# EAGLE design SimpleCodingBot (EAGLE 9.4.2)
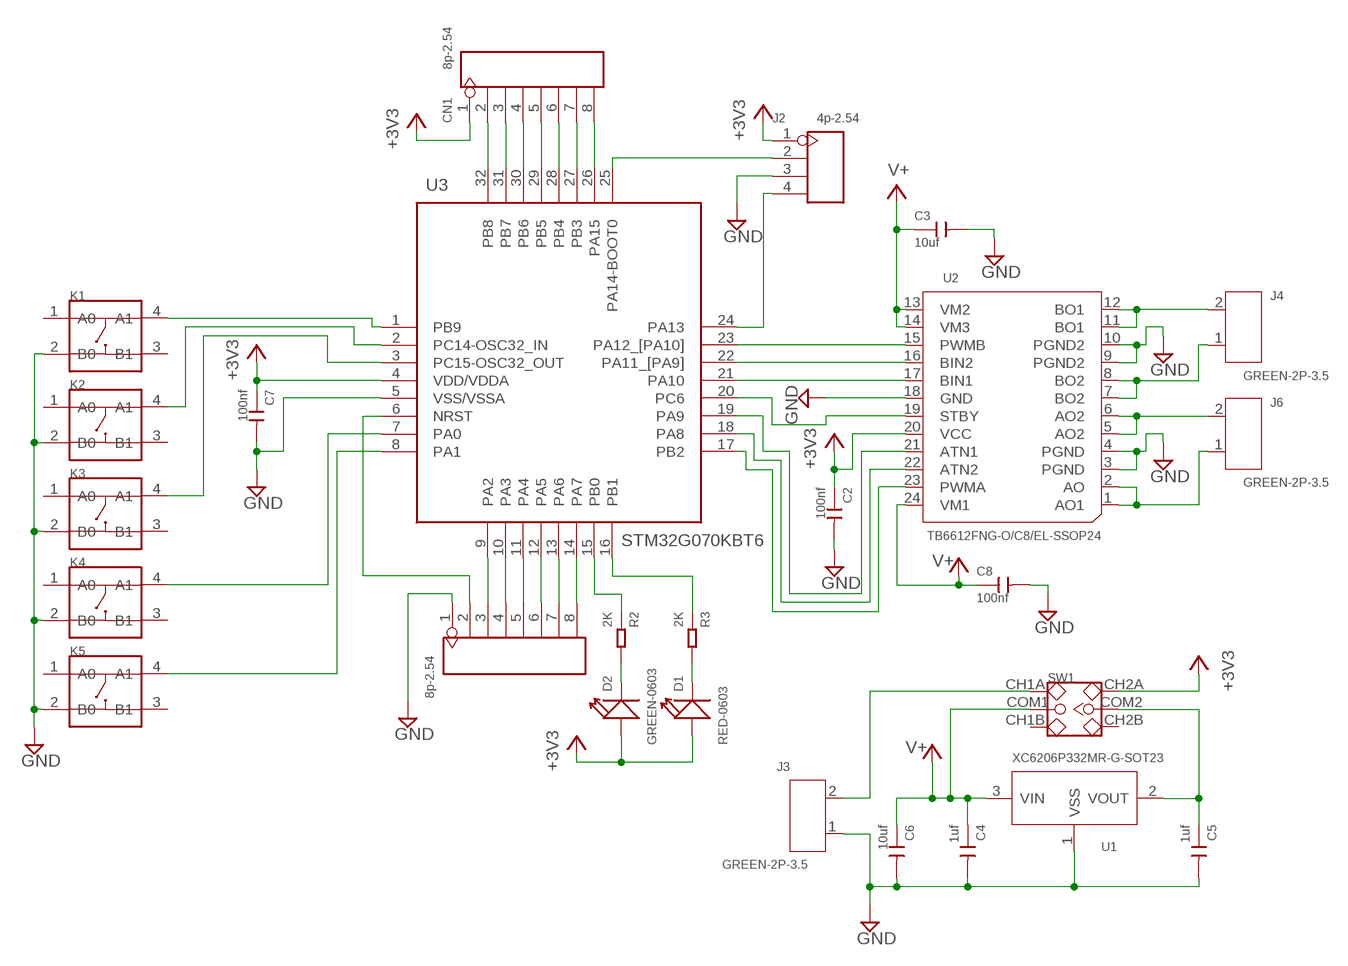
[diagram p0: schematic, sheet 1]

## Parts
C2  100nf  CERAMIC-100NF-50V-10%-X7R(0603)  [C0603]
C3  10uf  CERAMIC-10UF-10V-10%-X5R(0603)  [C0603]
C4  1uf  CERAMIC-1UF-25V-10%-X7R(0603)  [C0603]
C5  1uf  CERAMIC-1UF-25V-10%-X7R(0603)  [C0603]
C6  10uf  CERAMIC-10UF-10V-10%-X5R(0603)  [C0603]
C7  100nf  CERAMIC-100NF-50V-10%-X7R(0603)  [C0603]
C8  100nf  CERAMIC-100NF-50V-10%-X7R(0603)  [C0603]
CN1  8p-2.54  DIP-BLACK-FEMALE-HEADER-VERT(8P-2.54)  [H8-2.54]
CN2  8p-2.54  DIP-BLACK-FEMALE-HEADER-VERT(8P-2.54)  [H8-2.54]
D1  RED-0603  LED-SMD-RED-DIFFUSED(0603)  [LED-0603]
D2  GREEN-0603  SMD-LED-CLEAR-GREEN(0603)  [LED-0603]
J2  4p-2.54  DIP-BLACK-MALE-HEADER-VERT(4P-2.54)  [H4-2.54]
J3  GREEN-2P-3.5  SCREW-TERMINAL-GREEN(2P-3.5)  [H2-3.5-7.0X7.0MM]
J4  GREEN-2P-3.5  SCREW-TERMINAL-GREEN(2P-3.5)  [H2-3.5-7.0X7.0MM]
J6  GREEN-2P-3.5  SCREW-TERMINAL-GREEN(2P-3.5)  [H2-3.5-7.0X7.0MM]
K1  DIP-SWITCH-TACTILE-SPST-NO/TS-1109(4P-D6.0MM)'TS-1109'  [SW4-6.0X6.0X5.0MM]
K2  DIP-SWITCH-TACTILE-SPST-NO/TS-1109(4P-D6.0MM)'TS-1109'  [SW4-6.0X6.0X5.0MM]
K3  DIP-SWITCH-TACTILE-SPST-NO/TS-1109(4P-D6.0MM)'TS-1109'  [SW4-6.0X6.0X5.0MM]
K4  DIP-SWITCH-TACTILE-SPST-NO/TS-1109(4P-D6.0MM)'TS-1109'  [SW4-6.0X6.0X5.0MM]
K5  DIP-SWITCH-TACTILE-SPST-NO/TS-1109(4P-D6.0MM)'TS-1109'  [SW4-6.0X6.0X5.0MM]
R2  2K  SMD-RES-2K-1%-1/10W(0603)  [R0603]
R3  2K  SMD-RES-2K-1%-1/10W(0603)  [R0603]
SW1  DIP-TOGGLE-SWITCH-2CH-(2X3P-2.54)  [SW6-2.54-9.0X3.5X3.2+2.0MM]
U1  XC6206P332MR-G-SOT23  PMIC-LDO-XC6206P332MR-G(SOT23)  [SOT-23]
U2  TB6612FNG-O/C8/EL-SSOP24  DRIVER-TB6612FNG-O/C8/EL(SSOP24)  [SSOP24-0.65-8.9X5.3MM]
U3  STM32G070KBT6  [QFP80P900X900X160-32N]

## Nets
+3V3: C2.1 C7.1 CN1.1 D1.+ D2.+ J2.1 SW1.CH2A U2.20(VCC) U3.4(VDD/VDDA)
GND: C2.2 C3.2 C4.2 C5.2 C6.2 C7.2 C8.2 CN2.1 J2.3 J3.1 K1.2(B0) K2.2(B0) K3.2(B0) K4.2(B0) K5.2(B0) U1.1(VSS) U2.3(PGND) U2.4(PGND) U2.9(PGND2) U2.10(PGND2) U2.18(GND) U3.5(VSS/VSSA)
N$1: CN1.6 U3.28(PB4)
N$2: C5.1 SW1.COM2 U1.2(VOUT)
N$3: K1.4(A1) U3.1(PB9)
N$4: K2.4(A1) U3.2(PC14-OSC32_IN)
N$5: K3.4(A1) U3.3(PC15-OSC32_OUT)
N$6: K4.4(A1) U3.7(PA0)
N$7: K5.4(A1) U3.8(PA1)
N$8: J2.2 U3.25(PA14-BOOT0)
N$9: J2.4 U3.24(PA13)
N$10: D1.- R3.2
N$11: J3.2 SW1.CH1A
N$13: R3.1 U3.16(PB1)
N$14: R2.1 U3.15(PB0)
N$15: CN2.8 U3.14(PA7)
N$16: U2.15(PWMB) U3.23(PA12_[PA10])
N$17: U2.16(BIN2) U3.22(PA11_[PA9])
N$18: CN1.5 U3.29(PB5)
N$19: CN1.4 U3.30(PB6)
N$20: CN1.3 U3.31(PB7)
N$21: CN1.2 U3.32(PB8)
N$22: U2.17(BIN1) U3.21(PA10)
N$23: CN2.7 U3.13(PA6)
N$24: CN2.6 U3.12(PA5)
N$25: CN1.7 U3.27(PB3)
N$26: CN2.5 U3.11(PA4)
N$27: U2.21(ATN1) U3.19(PA9)
N$28: CN2.4 U3.10(PA3)
N$29: U2.22(ATN2) U3.18(PA8)
N$30: U2.23(PWMA) U3.17(PB2)
N$31: CN2.3 U3.9(PA2)
N$32: U2.19(STBY) U3.20(PC6)
N$33: CN1.8 U3.26(PA15)
N$34: D2.- R2.2
N$35: CN2.2 U3.6(NRST)
N$37: J4.2 U2.11(BO1) U2.12(BO1)
N$38: J4.1 U2.7(BO2) U2.8(BO2)
N$40: J6.2 U2.5(AO2) U2.6(AO2)
N$42: J6.1 U2.1(AO1) U2.2(AO)
V+: C3.1 C4.1 C6.1 C8.1 SW1.COM1 U1.3(VIN) U2.13(VM2) U2.14(VM3) U2.24(VM1)
Unconnected: K1.1(A0) K1.3(B1) K2.1(A0) K2.3(B1) K3.1(A0) K3.3(B1) K4.1(A0) K4.3(B1) K5.1(A0) K5.3(B1) SW1.CH1B SW1.CH2B

## Library data of the parts
C2 C7 C8 = OPL_Capacitor:CERAMIC-100NF-50V-10%-X7R(0603): 302010138; MPN: CC0603KRX7R9BB104
C3 C6 = OPL_Capacitor:CERAMIC-10UF-10V-10%-X5R(0603): 302010103; MPN: CC0603KRX5R6BB106
C4 C5 = OPL_Capacitor:CERAMIC-1UF-25V-10%-X7R(0603): 302010139; MPN: CC0603KRX7R8BB105
CN1 CN2 = OPL_Connector:DIP-BLACK-FEMALE-HEADER-VERT(8P-2.54): 320030061; MPN: F185-1108A1BSYC1
D1 = OPL_Optoelectronics:LED-SMD-RED-DIFFUSED(0603): 304090042; MPN: 19-217-R6C-AL1M2VY-3T
D2 = OPL_Optoelectronics:SMD-LED-CLEAR-GREEN(0603): 304090043; MPN: 19-217-G7C-AN1P2-3T
J2 = OPL_Connector:DIP-BLACK-MALE-HEADER-VERT(4P-2.54): 320020017; MPN: P125-1104A0BS116A1
J3 J4 J6 = OPL_Connector:SCREW-TERMINAL-GREEN(2P-3.5): 320110028
K1-K5 = OPL_Switch:DIP-SWITCH-TACTILE-SPST-NO/TS-1109(4P-D6.0MM): 311020024
R2 R3 = OPL_Resistor:SMD-RES-2K-1%-1/10W(0603): 301010221; MPN: RC0603FR-072KL
SW1 = OPL_Switch:DIP-TOGGLE-SWITCH-2CH-(2X3P-2.54): 311010004; MPN: MS-22D18 G2 ROHS
U1 = OPL_IC:PMIC-LDO-XC6206P332MR-G(SOT23): 310030099; MPN: XC6206P332MR-G
U2 = OPL_IC:DRIVER-TB6612FNG-O/C8/EL(SSOP24): 310040007; MPN: TB6612FNG-O/C8/EL
U3 = SamacSys_Parts:STM32G070KBT6: 32-bit Microcontrollers - MCU Arm Cortex -M0+ 32-bit MCU, 128 KB Flash, 36 KB RAM, 4x USART, timers, ADC, comm. I/Fs, 2.0-3.6V Source: Datasheet <https://componentsearchengine.com/Datasheets/1/STM32G070KBT6.pdf>; DESCRIPTION: 32-bit Microcontrollers - MCU Arm Cortex -M0+ 32-bit MCU, 128 KB Flash, 36 KB RAM, 4x USART, timers, ADC, comm. I/Fs, 2.0-3.6V; HEIGHT: 1.6mm; MANUFACTURER_NAME: STMicroelectronics; MANUFACTURER_PART_NUMBER: STM32G070KBT6; MOUSER_PART_NUMBER: 511-STM32G070KBT6; MOUSER_PRICE-STOCK: https://www.mouser.com/Search/Refine.aspx?Keyword=511-STM32G070KBT6

## Net classes
0 default: width 0.254 mm, clearance 0.152 mm

## Board
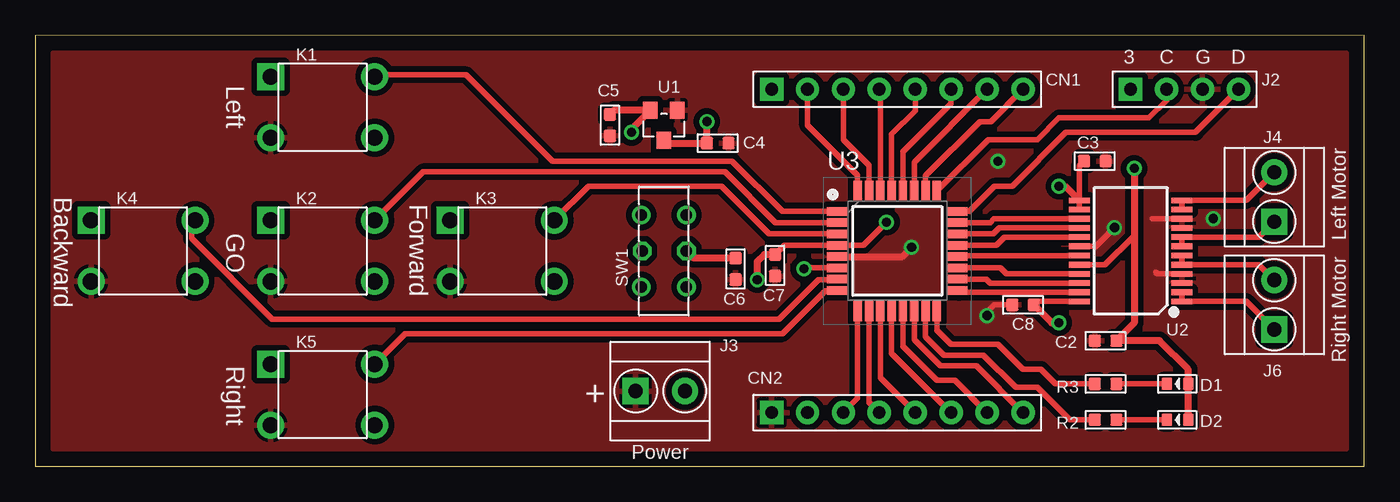
[diagram p1: board, top side]
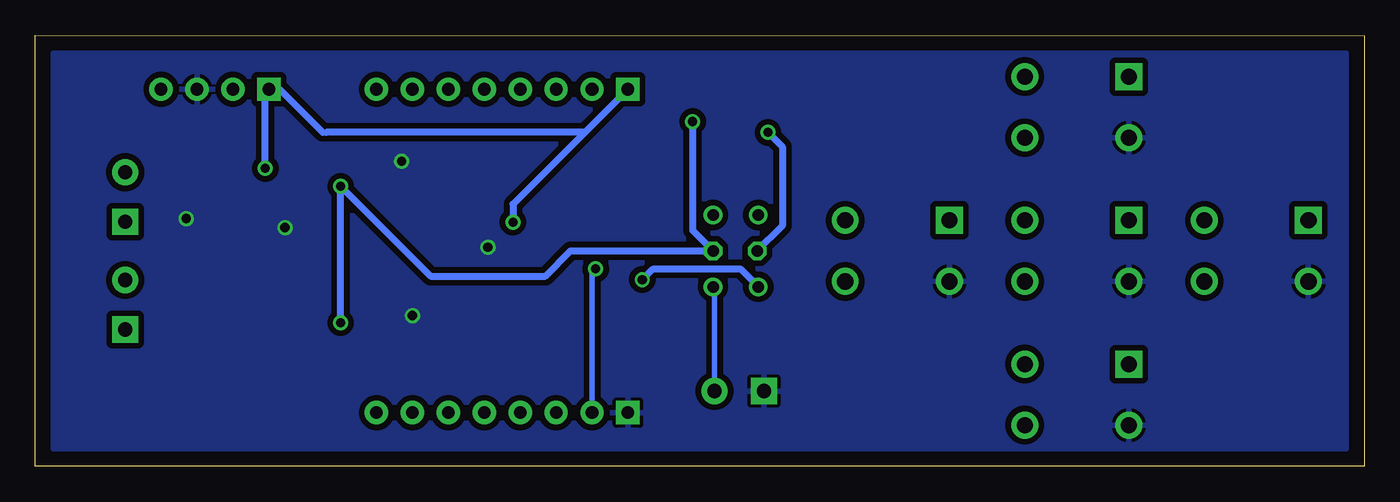
[diagram p2: board, bottom side, seen from below]

Size 93.98 x 30.48 mm. Coordinates in mm from the lower left corner, seen from the top.
Outline: 0,0 93.98,0 93.98,30.48 0,30.47 0,0
Copper layers (1*16): Top 0.035mm / dielectric 1.5mm / Bottom 0.035mm
Design rules "default *": minimum track width 10mil, minimum drill 0.35mm, track to track 10mil, track to pad 6mil, pad to pad 6mil, via to via 10mil, smd to smd 0mil, copper to edge 40mil, drill to drill 6mil, minimum pad ring 10mil, minimum via ring 8mil, stop-mask expansion 4mil, vias tented up to drill 0mil, thermal gap 10mil

### Footprints (pad centres in the part's own frame; a part is rotated, then mirrored left to right if it is on the bottom)
C0603 = smd 0.889 x 0.889: 1 0,0.762; 2 0,-0.762
H8-2.54 = drill 0.889 pad 1.651 square: 1 0,8.89 | drill 0.889 pad 1.651: 2 0,6.35; 3 0,3.81; 4 0,1.27; 5 0,-1.27; 6 0,-3.81; 7 0,-6.35; 8 0,-8.89
LED-0603 = smd 0.762 x 0.889: + -0.762,0; - 0.762,0
H4-2.54 = drill 0.889 pad 1.651 square: 1 0,3.81 | drill 0.889 pad 1.651: 2 0,1.27; 3 0,-1.27; 4 0,-3.81
H2-3.5-7.0X7.0MM = drill 1 pad 1.85 square: 1 -1.75,0 | drill 1 pad 1.85: 2 1.75,0
SW4-6.0X6.0X5.0MM = drill 1.143 pad 1.905 square: 1 -3.683,2.159 | drill 1.143 pad 1.905: 2 -3.683,-2.159; 3 3.683,-2.159; 4 3.683,2.159
R0603 = smd 0.889 x 0.889: 1 0,0.762; 2 0,-0.762
SW6-2.54-9.0X3.5X3.2+2.0MM = drill 0.813 pad 1.27: CH1A -2.54,-1.6; CH1B 2.54,-1.6; CH2A -2.54,1.6; CH2B 2.54,1.6 | drill 0.813 pad 1.27 octagon: COM1 0,-1.6; COM2 0,1.524
SOT-23 = smd 1.016 x 1.2: 1 -0.95,-1.06; 2 0.95,-1.06; 3 0,1.06
SSOP24-0.65-8.9X5.3MM = smd 0.4 x 1.5: 1 -3.575,-3.625; 2 -2.925,-3.625; 3 -2.275,-3.625; 4 -1.625,-3.625; 5 -0.975,-3.625; 6 -0.325,-3.625; 7 0.325,-3.625; 8 0.975,-3.625; 9 1.625,-3.625; 10 2.275,-3.625; 11 2.925,-3.625; 12 3.575,-3.625; 13 3.575,3.625; 14 2.925,3.625; 15 2.275,3.625; 16 1.625,3.625; 17 0.975,3.625; 18 0.325,3.625; 19 -0.325,3.625; 20 -0.975,3.625; 21 -1.625,3.625; 22 -2.275,3.625; 23 -2.925,3.625; 24 -3.575,3.625
QFP80P900X900X160-32N = smd 1.475 x 0.6: 1 -4.238,2.8; 2 -4.238,2; 3 -4.238,1.2; 4 -4.238,0.4; 5 -4.238,-0.4; 6 -4.238,-1.2; 7 -4.238,-2; 8 -4.238,-2.8; 17 4.238,-2.8; 18 4.238,-2; 19 4.238,-1.2; 20 4.238,-0.4; 21 4.238,0.4; 22 4.238,1.2; 23 4.238,2; 24 4.238,2.8 | smd 0.6 x 1.475: 9 -2.8,-4.238; 10 -2,-4.238; 11 -1.2,-4.238; 12 -0.4,-4.238; 13 0.4,-4.238; 14 1.2,-4.238; 15 2,-4.238; 16 2.8,-4.238; 25 2.8,4.238; 26 2,4.238; 27 1.2,4.238; 28 0.4,4.238; 29 -0.4,4.238; 30 -1.2,4.238; 31 -2,4.238; 32 -2.8,4.238

### Placement (x,y rotation side)
C2  75.69,8.89 270 top
C3  74.93,21.59 90 top
C4  48.26,22.86 90 top
C5  40.64,24.13 0 top
C6  49.53,13.97 0 top
C7  52.32,14.22 0 top
C8  69.85,11.43 270 top
CN1  60.96,26.67 90 top
CN2  60.96,3.81 90 top
D1  80.77,5.84 180 top
D2  80.77,3.3 180 top
J2  81.28,26.67 90 top
J3  44.2,5.33 0 top
J4  87.63,19.05 90 top
J6  87.63,11.43 90 top
K1  20.32,25.4 0 top
K2  20.32,15.24 0 top
K3  33.02,15.24 0 top
K4  7.62,15.24 0 top
K5  20.32,5.08 0 top
R2  75.69,3.3 90 top
R3  75.69,5.84 90 top
SW1  44.45,15.24 90 top
U1  44.45,24.13 180 top
U2  77.47,15.24 90 top
U3  60.96,15.24 0 top

### Tracks (layer width: path | path; a pad name or v marks a point on that pad's centre or on a via)
+3V3  (via drill 0.65)
  Top 0.381: C7.1 52.98,15.64 U3.4 58.57,15.64 v60.2,17.27 | D2.+ D1.+ 81.53,6.1 81.53,6.86 | v77.72,21.08 77.72,16.26 77.64,16.26 75.65,14.27 U2.20
  Top 0.508: C7.1 51.56,14.99 51.05,14.48 v51.05,13.21 | D2.+ 81.53,6.1 | D1.+ 81.53,6.86 79.5,8.89 C2.1 77.72,10.16 v77.72,21.08
  Bottom 0.381: 73.41,23.62 73.66,23.62
  Bottom 0.508: 55.12,23.62 CN1.1 | 55.12,23.62 60.2,18.54 v60.2,17.27 | 55.12,23.62 73.41,23.62 | 73.66,23.62 76.71,26.67 J2.1 77.72,26.42 v77.72,21.08 | v51.05,13.21 50.29,13.97 44.12,13.97 SW1.CH2A
GND  (via drill 0.65)
  Top 0.381: U2.18 74.86,15.56 74.93,15.49 v76.33,16.89 | C8.2 67.82,11.43 67.31,10.92 v67.31,10.67 | U2.10 79,17.52 78.99,17.53 | U2.4 79.35,13.62 79.25,13.72
  Top 0.508: U3.5 61.32,14.84 v61.98,15.49
  other vias: 68.07,21.59 83.31,17.53
  pour Top (isolate 0.406): 1.27,1.27 92.71,1.27 92.71,29.21 1.27,29.21
  pour Bottom (isolate 0.406): 1.27,29.21 1.27,1.27 92.71,1.27 92.71,29.21
N$1
  Top 0.381: U3.28 61.36,22.24 64.77,25.65 CN1.6
N$2  (via drill 0.65)
  Top 0.508: C5.1 40.94,25.19 U1.2 42.16,23.85 v42.16,23.62
  Bottom 0.508: SW1.COM2 41.15,17.02 41.15,22.61 v42.16,23.62
N$3
  Top 0.381: U3.1 52.83,18.04 49.28,21.59 36.58,21.59 30.48,27.69 24.13,27.69 K1.4
N$4
  Top 0.381: U3.2 52.36,17.24 48.77,20.83 27.43,20.83 K2.4
N$5
  Top 0.381: U3.3 51.89,16.44 48.51,19.81 39.12,19.81 K3.4
N$6
  Top 0.381: U3.7 56.69,13.21 55.37,13.21 52.58,10.41 16.76,10.41 11.05,16.13 11.05,17.14 K4.4
N$7
  Top 0.381: K5.4 26.16,9.4 52.83,9.4 55.87,12.44 U3.8
N$8
  Top 0.381: U3.25 67.4,23.11 70.87,23.11 72.39,24.64 78.74,24.64 80.01,25.91 J2.2
N$9
  Top 0.381: J2.4 82.04,23.62 72.9,23.62 69.09,19.81 67.82,19.81 66.05,18.04 U3.24
N$10
  Top 0.381: D1.- R3.2
N$11
  Bottom 0.381: SW1.CH1A 45.95,12.6 J3.2
N$13
  Top 0.381: U3.16 63.76,9.65 64.77,8.64 68.07,8.64 69.85,6.86 71.12,6.86 72.14,5.84 R3.1
N$14
  Top 0.381: U3.15 62.96,9.18 64.26,7.87 67.06,7.87 69.34,5.59 70.87,5.59 73.15,3.3 R2.1
N$15
  Top 0.381: U3.14 62.16,8.96 64.01,7.11 66.55,7.11 CN2.8
N$16
  Top 0.381: U2.15 67.81,17.52 67.53,17.24 U3.23
N$17
  Top 0.381: U2.16 68.17,16.86 67.75,16.44 U3.22
N$18
  Top 0.381: U3.29 60.56,23.48 62.23,25.15 CN1.5
N$19
  Top 0.381: U3.30 59.76,26.6 CN1.4
N$20
  Top 0.381: U3.31 58.96,21.3 57.15,23.11 CN1.3
N$21
  Top 0.381: U3.32 58.16,20.58 54.61,24.13 CN1.2
N$22
  Top 0.381: U2.17 68.54,16.21 67.96,15.64 U3.21
N$23
  Top 0.381: 61.36,8.49 U3.13 61.36,8.49 | CN2.7 65.02,6.1 63.75,6.1 61.36,8.49
N$24
  Top 0.381: U3.12 60.56,8.02 CN2.6
N$25
  Top 0.381: U3.27 62.16,21.52 CN1.7
N$26
  Top 0.381: U3.11 59.76,6.28 CN2.5
N$27
  Top 0.381: U2.21 68.68,13.62 68.26,14.04 U3.19
N$28
  Top 0.381: U3.10 58.96,4.54 CN2.4
N$29
  Top 0.381: U2.22 67.55,12.96 67.28,13.24 U3.18
N$30
  Top 0.381: U3.17 65.32,12.31 68.52,12.31 68.52,12.32 71.18,12.32 71.18,12.31 U2.23
N$31
  Top 0.381: U3.9 58.16,4.82 CN2.3
N$32
  Top 0.381: U3.20 65.25,14.9 66.12,14.9 66.14,14.91 U2.19
N$33
  Top 0.381: U3.26 62.96,20.54 66.8,24.38 67.56,24.38 CN1.8
N$34
  Top 0.381: D2.- R2.2
N$35  (via drill 0.65)
  Top 0.381: U3.6 54.43,14.04 v54.36,13.97
  Bottom 0.381: v54.36,13.97 54.61,13.72 CN2.2
N$37
  Top 0.381: U2.11 U2.12 85.64,18.82 J4.2
N$38
  Top 0.381: U2.7 U2.8 86.55,16.21 J4.1
N$40
  Top 0.381: U2.6 U2.5 86.55,14.27 J6.2
N$42
  Top 0.381: U2.2 U2.1 85.64,11.66 J6.1
V+  (via drill 0.65)
  Top 0.381: U2.14 U2.13 73.84,21.27 C3.1 | U2.24 70.85,11.66 C8.1
  Top 0.508: U1.3 44.66,22.86 C4.1 v47.5,24.38 | C6.1 46.56,14.73 SW1.COM1 | U2.13 72.85,19.81 v72.39,19.81 | C8.1 71.88,10.16 v72.39,10.16
  Bottom 0.508: v47.5,24.38 47.5,16.69 SW1.COM1 56.13,15.24 57.91,13.46 66.04,13.46 v72.39,19.81 v72.39,10.16

### Text on the board
tNames: 3 | C | G | D | Left | Backward | Forward | GO | Left Motor | Right | Right Motor | + | Power